# Altium schematic sheet ESP_with_usb.SchDoc
size A
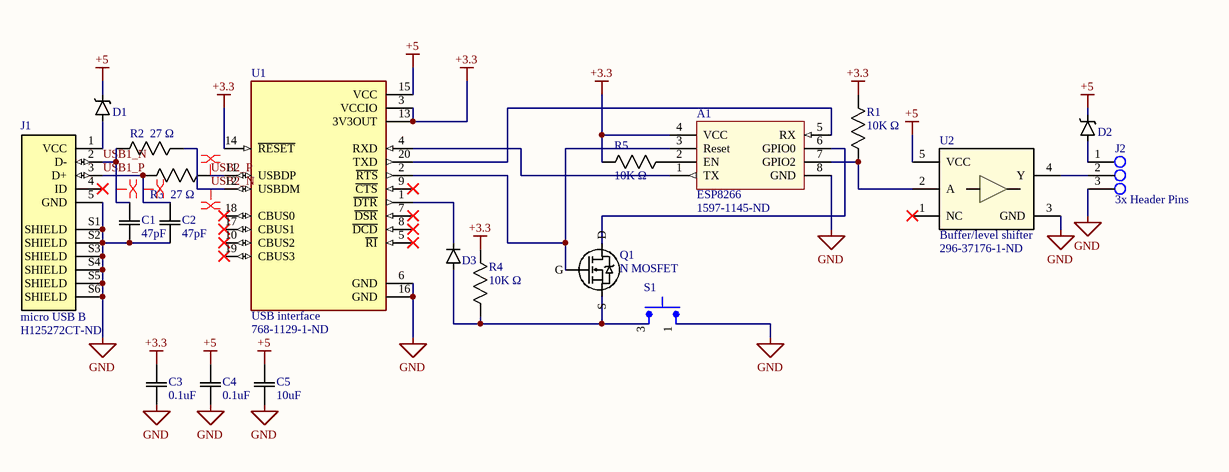
[diagram p0: ESP_with_usb.SchDoc]

## Parts
A1  ESP8266  Supplier Part Number 1: 1597-1145-ND  [ESP8266]
C1  47pF  [0603]
C2  47pF  [0603]
C3  0.1uF  [0603]
C4  0.1uF  [0603]
C5  10uF  [0603]
D1  Diode, Schottky  [SOD-523]  (value not drawn)
D2  Diode, Schottky  [SOD-523]  (value not drawn)
D3  Diode  [SOD-523]  (value not drawn)
J1  micro USB B  Supplier Part Number 1: H125272CT-ND  [Micro USB B (rev 2)]
J2  3x Header Pins  [3 HEADER PIN 90 DEG]
Q1  N MOSFET  [SOT-323]
R1  10K Ω  [0603]
R2  27 Ω  [0603]
R3  27 Ω  [0603]
R4  10K Ω  [0603]
R5  10K Ω  [0603]
S1  Pushbutton switch  [KS11R21]  (value not drawn)
U1  USB interface  Supplier Part Number 1: 768-1129-1-ND  [20-SSOP]
U2  Buffer/level shifter  Supplier Part Number 1: 296-37176-1-ND  [SOT-23-5]

## Nets
+3.3: A1.4(VCC) C3.2 R1.1 R4.1 R5.1 U1.3(VCCIO) U1.13(3V3OUT) U1.14(~{RESET})
+5: C4.2 C5.2 D1.C D2.C U1.15(VCC) U2.5(VCC)
GND: A1.8(GND) C1.1 C2.1 C3.1 C4.1 C5.1 J1.5(GND) J1.S1(SHIELD) J1.S2(SHIELD) J1.S3(SHIELD) J1.S4(SHIELD) J1.S5(SHIELD) J1.S6(SHIELD) J2.3 S1.1 U1.6(GND) U1.16(GND) U2.3(GND)
USB1_N: C1.2 J1.2(D-) R2.2
USB1_P: C2.2 J1.3(D+) R3.2
USB2_N: R2.1 U1.12(USBDM)
USB2_P: R3.1 U1.11(USBDP)
NetA1_1: A1.1(TX) U1.4(RXD)
NetA1_2: A1.2(EN) R5.2
NetA1_3: A1.3(Reset) Q1.1(G) U1.2(~{RTS})
NetA1_5: A1.5(RX) U1.20(TXD)
NetA1_6: A1.6(GPIO0) Q1.3(D)
NetA1_7: A1.7(GPIO2) R1.2 U2.2(A)
NetD1_A: D1.A J1.1(VCC)
NetD2_A: D2.A J2.1
NetD3_A: D3.A Q1.2(S) R4.2 S1.3
NetD3_C: D3.C U1.1(~{DTR})
NetJ2_2: J2.2 U2.4(Y)

Not connected (* = marked no-connect by the designer): J1 4(ID)*; U1 5(~{RI})* 7(~{DSR})* 8(~{DCD})* 9(~{CTS})* 10(CBUS2)* 17(CBUS1)* 18(CBUS0)* 19(CBUS3)*; U2 1(NC)*

## Layout directives
differential pair: USB1_N, USB1_P, USB2_N, USB2_P

## Library data of the parts
A1 = ESP8266: RX TXRX MODULE WIFI TRACE ANT TH; Supplier 1: Digi-Key
C1 C2 = CL10C470JC8NNNC: CAP CER 47PF 100V C0G/NP0 0603; Manufacturer_Part_Number: CC0805KRX7R9BB104; Vendor: Yageo; Built_By: EMA_UL_Team; Type: DEV; Copyright: Copyright (C) 2018 Accelerated Designs. All rights reserved; RefDes: RefDes; Value: Value; Supplier 1: Digi-Key; Supplier Part Number 1: 1276-2299-1-ND
C3 C4 = CL10B104KB8NNNC: CAP CER 0.1UF 50V X7R 0603; Manufacturer_Part_Number: CC0805KRX7R9BB104; Vendor: Yageo; Built_By: EMA_UL_Team; Type: DEV; Copyright: Copyright (C) 2018 Accelerated Designs. All rights reserved; RefDes: RefDes; Value: Value; Supplier 1: Digi-Key; Supplier Part Number 1: 1276-1000-1-ND
C5 = 0603ZD106KAT2A: CAP CER 10UF 10V X5R 0603; Manufacturer_Part_Number: CC0805KRX7R9BB104; Vendor: Yageo; Built_By: EMA_UL_Team; Type: DEV; Copyright: Copyright (C) 2018 Accelerated Designs. All rights reserved; RefDes: RefDes; Value: Value; Supplier 1: Digi-Key; Supplier Part Number 1: 478-10766-1-ND
D1 D2 = RB520S30T1G: DIODE SCHOTTKY 30V 200MA SOD523; MP: BAT20JFILM; MF: STMicroelectronics; Package: SOD-323 STMicroelectronics; SnapEDA_Link: https://www.snapeda.com/parts/BAT20JFILM/STMicroelectronics/view-part/110314/?ref=snap; Value: *; Availability: Unavailable; Price: None; Supplier 1: Digi-Key; Supplier Part Number 1: RB520S30T1GOSCT-ND
D3 = 1N4148X-TP: DIODE GEN PURP 75V 150MA SOD523; MP: BAT20JFILM; MF: STMicroelectronics; Package: SOD-323 STMicroelectronics; SnapEDA_Link: https://www.snapeda.com/parts/BAT20JFILM/STMicroelectronics/view-part/110314/?ref=snap; Value: *; Availability: Unavailable; Price: None; Supplier 1: Digi-Key; Supplier Part Number 1: 1N4148XTPMSCT-ND
J1 = ZX62D-B-5P8(30): CONN RCPT USB2.0 MICRO B SMD R/A; SourceLibrary: Hirose_2020-02-14; Vendor: Hirose; Built_By: EMA_Colton; Manufacturer_Part_Number: ZX62D-B-5P8(30); Copyright: Copyright (C) 2018 Accelerated Designs. All rights reserved; Datasheet: https://www.digikey.com/product-detail/en/hirose-electric-co-ltd/ZX62D-B-5P8-30/H125272TR-ND/5994738; RefDes: RefDes; Type: DEV; Supplier 1: Digi-Key
J2 = 3x Header Pin: CONN HEADER VERT 5POS 2.54MM; Manufacturer_Part_Number: 77311-818-36LF; Vendor: Amphenol; Built_By: EMA_UL_Team; SourceLibrary: Amphenol_2013-08-06_Bergstik_1Row_77311; Copyright: Copyright (C) 2018 Accelerated Designs. All rights reserved; RefDes: RefDes; Type: DEV; Value: Value
Q1 = 2N7002PW,115: MOSFET N-CH 60V 0.31A SOT323; Manufacturer_Part_Number: 2N7002,215; Vendor: NXP; Built_By: EMA_UL_Team; SourceLibrary: NXP_2011-01-01; Type: DEV; Copyright: Copyright (C) 2018 Accelerated Designs. All rights reserved; RefDes: RefDes; Supplier 1: Digi-Key; Supplier Part Number 1: 1727-4793-1-ND
R1 R4 R5 = RNCP0603FTD10K0: RES 10K OHM 1% 1/8W 0603; Manufacturer_Part_Number: RC0805FR-0710KL; Vendor: Yageo; Built_By: EMA_UL_Team; Copyright: Copyright (C) 2018 Accelerated Designs. All rights reserved; RefDes: RefDes; Type: DEV; Value: Value; Supplier 1: Digi-Key; Supplier Part Number 1: RNCP0603FTD10K0CT-ND
R2 R3 = RC0603FR-0727RL: RES SMD 27 OHM 1% 1/10W 0603; Manufacturer_Part_Number: RC0805FR-0710KL; Vendor: Yageo; Built_By: EMA_UL_Team; Copyright: Copyright (C) 2018 Accelerated Designs. All rights reserved; RefDes: RefDes; Type: DEV; Value: Value; Supplier 1: Digi-Key; Supplier Part Number 1: 311-27.0HRCT-ND
S1 = KS11R27CQD: SWITCH PUSH SPST-NO 0.025A 50V; MF: C&K; MP: KS11R21CQD; Package: None; Value: *; Digi-Key_Part_Number: CKN4078-ND; Digi-Key_Purchase_URL: https://www.digikey.com/product-detail/en/c-k/KS11R21CQD/CKN4078-ND/332668?utm_source=snapeda&utm_medium=aggregator&utm_campaign=symbol; SnapEDA_Link: https://www.snapeda.com/parts/KS11R21CQD/C%26K/view-part/288209/?ref=snap; Supplier 1: Digi-Key; Supplier Part Number 1: CKN1592-ND
U1 = FT231XS-R: USB Bridge, USB to UART USB 2.0 UART Interface 20-SSOP; MF: FTDI,; Price: None; Package: SSOP-20 FTDI; Value: *; MP: FT231XS-R; Availability: Unavailable; SnapEDA_Link: https://www.snapeda.com/parts/FT231XS-R/FTDI%2C%20Future%20Technology%20Devices%20International%20Ltd/view-part/48872/?ref=snap; Supplier 1: Digi-Key
U2 = SN74LV1T34DBVR: IC BUF NON-INVERT 5.5V SOT23-5; Manufacturer: Texas Instruments; PIN_COUNT: 5; SymbolVerison: 2014-09-28; PartNumber: SN74LV1T34DBV; PackageReference: DBV0005A; MountType: SMT; CompType: IC; RoHS: Y; RefDes: RefDes; Type: DEV; Value: Value; Copyright: Copyright (C) 2018 Accelerated Designs. All rights reserved; Supplier 1: Digi-Key